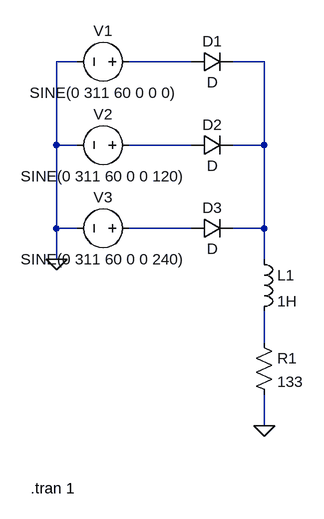
[diagram p0: schematic Draft1.asc]
Draft1.asc, the LTspice schematic file:
Version 4.1
SHEET 1 880 720
WIRE 80 48 48 48
WIRE 256 48 160 48
WIRE 368 48 320 48
WIRE 48 176 48 48
WIRE 80 176 48 176
WIRE 256 176 160 176
WIRE 368 176 368 48
WIRE 368 176 320 176
WIRE 48 304 48 176
WIRE 80 304 48 304
WIRE 256 304 160 304
WIRE 368 304 368 176
WIRE 368 304 320 304
WIRE 48 352 48 304
WIRE 368 352 368 304
WIRE 368 480 368 432
WIRE 368 608 368 560
FLAG 48 352 0
FLAG 368 608 0
SYMBOL voltage 176 48 R90
WINDOW 0 -32 56 VBottom 2
WINDOW 3 32 56 VTop 2
WINDOW 123 0 0 Left 0
WINDOW 39 0 0 Left 0
SYMATTR InstName V1
SYMATTR Value SINE(0 311 60 0 0 0)
SYMBOL voltage 176 176 R90
WINDOW 0 -32 56 VBottom 2
WINDOW 3 32 56 VTop 2
WINDOW 123 0 0 Left 0
WINDOW 39 0 0 Left 0
SYMATTR InstName V2
SYMATTR Value SINE(0 311 60 0 0 120)
SYMBOL voltage 176 304 R90
WINDOW 0 -32 56 VBottom 2
WINDOW 3 32 56 VTop 2
WINDOW 123 0 0 Left 0
WINDOW 39 0 0 Left 0
SYMATTR InstName V3
SYMATTR Value SINE(0 311 60 0 0 240)
SYMBOL diode 256 64 R270
WINDOW 0 32 32 VTop 2
WINDOW 3 0 32 VBottom 2
SYMATTR InstName D1
SYMBOL diode 256 192 R270
WINDOW 0 32 32 VTop 2
WINDOW 3 0 32 VBottom 2
SYMATTR InstName D2
SYMBOL diode 256 320 R270
WINDOW 0 32 32 VTop 2
WINDOW 3 0 32 VBottom 2
SYMATTR InstName D3
SYMBOL ind 352 336 R0
SYMATTR InstName L1
SYMATTR Value 1H
SYMBOL res 352 464 R0
SYMATTR InstName R1
SYMATTR Value 133
TEXT 8 704 Left 2 !.tran 1

The netlist it stands for:
* Draft1.asc
V1 N001 0 SINE(0 311 60 0 0 0)
V2 N003 0 SINE(0 311 60 0 0 120)
V3 N004 0 SINE(0 311 60 0 0 240)
D1 N001 N002 D
D2 N003 N002 D
D3 N004 N002 D
L1 N002 N005 1H
R1 N005 0 133
.model D D
.lib standard.dio
.tran 1
.backanno
.end